# EAGLE design garden_logger (EAGLE 7.7.0)
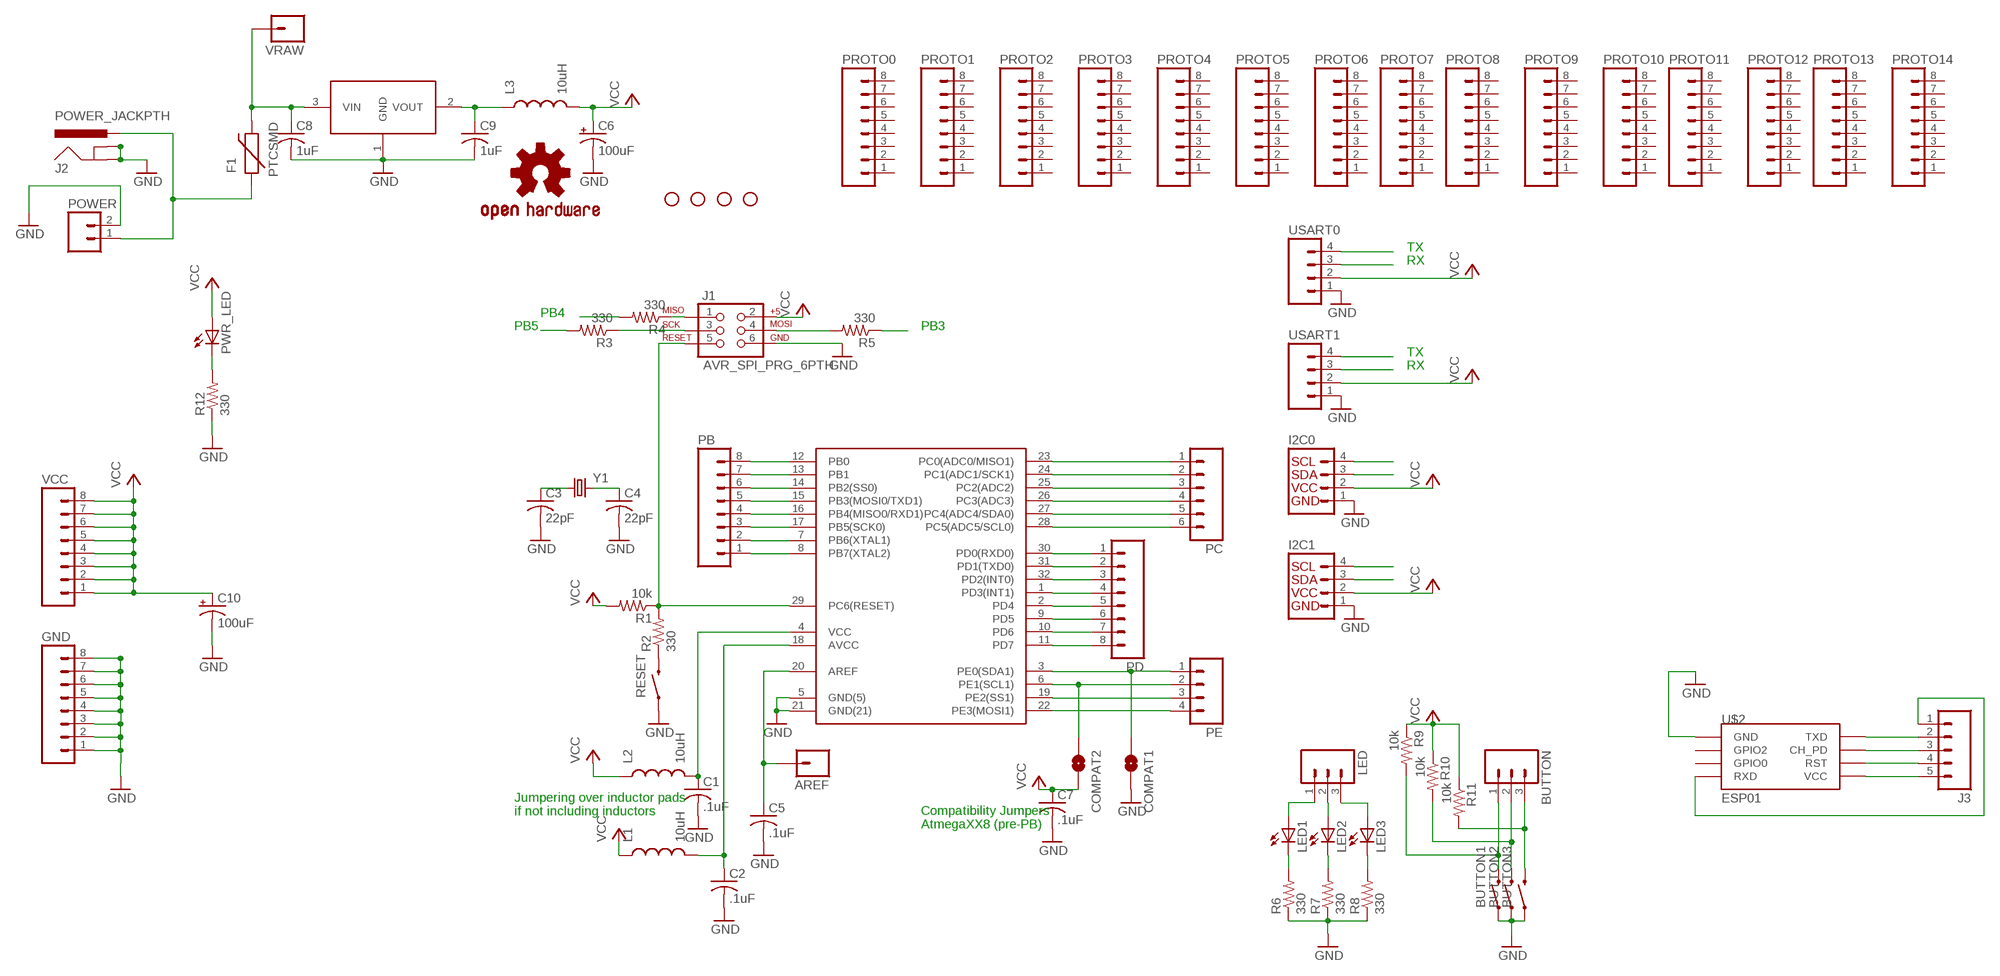
[diagram p0: schematic, sheet 1]

## Parts
AREF  M01PTH  [1X01]
BUTTON  M03PTH  [1X03]
BUTTON1  SWITCH-MOMENTARY-2PTH  [TACTILE-PTH]
BUTTON2  SWITCH-MOMENTARY-2PTH  [TACTILE-PTH]
BUTTON3  SWITCH-MOMENTARY-2PTH  [TACTILE-PTH]
C1  .1uF  C-USC0805  [C0805]
C2  .1uF  C-USC0805  [C0805]
C3  22pF  C-USC0805  [C0805]
C4  22pF  C-USC0805  [C0805]
C5  .1uF  C-USC0805  [C0805]
C6  100uF  CAP_POLPTH1  [CPOL-RADIAL-100UF-25V]
C7  .1uF  C-USC0805  [C0805]
C8  1uF  C-USC0805  [C0805]
C9  1uF  C-USC0805  [C0805]
C10  100uF  CAP_POLPTH1  [CPOL-RADIAL-100UF-25V]
COMPAT1  SOLDERJUMPER-OLDNO  [SJ_2S-NO]
COMPAT2  SOLDERJUMPER-OLDNO  [SJ_2S-NO]
F1  PTCSMD  [PTC-1206]
GND  M08  [1X08_ROUND]
H1  STAND-OFF  [STAND-OFF]
H2  STAND-OFF  [STAND-OFF]
H3  STAND-OFF  [STAND-OFF]
H4  STAND-OFF  [STAND-OFF]
I2C0  I2C_STANDARD  [1X04]
I2C1  I2C_STANDARD  [1X04]
J1  AVR_SPI_PRG_6PTH  [2X3]
J2  POWER_JACKPTH  [POWER_JACK_PTH]
J3  M05PTH  [1X05]
L1  10uH  INDUCTOR0805  [0805]
L2  10uH  INDUCTOR0805  [0805]
L3  10uH  INDUCTOR0805  [0805]
LED  M03PTH  [1X03]
LED1  LEDCHIPLED_0805  [CHIPLED_0805]
LED2  LEDCHIPLED_0805  [CHIPLED_0805]
LED3  LEDCHIPLED_0805  [CHIPLED_0805]
LOGO1  OSHW-LOGOS  [OSHW-LOGO-S]
PB  M08  [1X08_ROUND]
PC  M06SILK_FEMALE_PTH  [1X06]
PD  M08  [1X08_ROUND]
PE  M04PTH  [1X04]
POWER  M02PTH  [1X02]
PROTO0  M08  [1X08_ROUND]
PROTO1  M08  [1X08_ROUND]
PROTO2  M08  [1X08_ROUND]
PROTO3  M08  [1X08_ROUND]
PROTO4  M08  [1X08_ROUND]
PROTO5  M08  [1X08_ROUND]
PROTO6  M08  [1X08_ROUND]
PROTO7  M08  [1X08_ROUND]
PROTO8  M08  [1X08_ROUND]
PROTO9  M08  [1X08_ROUND]
PROTO10  M08  [1X08_ROUND]
PROTO11  M08  [1X08_ROUND]
PROTO12  M08  [1X08_ROUND]
PROTO13  M08  [1X08_ROUND]
PROTO14  M08  [1X08_ROUND]
PWR_LED  LEDCHIPLED_0805  [CHIPLED_0805]
R1  10k  R-US_R0805  [R0805]
R2  330  R-US_R0805  [R0805]
R3  330  R-US_R0805  [R0805]
R4  330  R-US_R0805  [R0805]
R5  330  R-US_R0805  [R0805]
R6  330  R-US_R0805  [R0805]
R7  330  R-US_R0805  [R0805]
R8  330  R-US_R0805  [R0805]
R9  10k  R-US_R0805  [R0805]
R10  10k  R-US_R0805  [R0805]
R11  10k  R-US_R0805  [R0805]
R12  330  R-US_R0805  [R0805]
RESET  SWITCH-MOMENTARY-2PTH  [TACTILE-PTH]
U$1  ATMEGA328PB_TQFP  [TQFP32-08]
U$2  ESP01  [ESP01]
U$3  MCP1702  [SOT23-3]
USART0  M04PTH  [1X04]
USART1  M04PTH  [1X04]
VCC  M08  [1X08_ROUND]
VRAW  M01PTH  [1X01]
Y1  CRYSTALHC49US  [HC49US]

## Nets
AVCC: C2.1 L1.2 U$1.18(AVCC)
AVRVCC: C1.1 L2.2 U$1.4(VCC)
ESP01_CH_PD: J3.3 U$2.CH_PD
ESP01_RST: J3.4 U$2.RST
ESP01_RXD: J3.1 U$2.RX(RXD)
ESP01_TXD: J3.2 U$2.TX(TXD)
ESP01_VCC: J3.5 U$2.VCC
GND: BUTTON1.1 BUTTON2.1 BUTTON3.1 C1.2 C2.2 C3.2 C4.2 C5.2 C6.2(-) C7.2 C8.2 C9.2 C10.2(-) COMPAT1.2 GND.1 GND.2 GND.3 GND.4 GND.5 GND.6 GND.7 GND.8 I2C0.1 I2C1.1 J1.6 J2.GND J2.GNDBREAK POWER.2 R6.1 R7.1 R8.1 R12.1 RESET.1 U$1.5(GND(5)) U$1.21(GND(21)) U$2.GND U$3.1(GND) USART0.1 USART1.1
N$1: AREF.1 C5.1 U$1.20(AREF)
N$2: R2.1 RESET.3
N$3: J1.1 R4.1
N$4: J1.3 R3.1
N$5: J1.4 R5.2
N$8: C8.1 F1.2 U$3.3(VIN) VRAW.1
N$9: PWR_LED.C R12.2
N$10: F1.1 J2.PWR POWER.1
N$11: LED1.C R6.2
N$14: LED2.C R7.2
N$15: LED3.C R8.2
N$16: LED1.A LED.1
N$17: LED2.A LED.2
N$18: LED3.A LED.3
N$19: C9.1 L3.1 U$3.2(VOUT)
N$20: BUTTON3.3 BUTTON.3 R11.2
N$21: BUTTON2.3 BUTTON.2 R10.2
N$22: BUTTON1.3 BUTTON.1 R9.2
PB0: PB.8 U$1.12(PB0)
PB1: PB.7 U$1.13(PB1)
PB2: PB.6 U$1.14(PB2(SS0))
PB3: PB.5 R5.1 U$1.15(PB3(MOSI0/TXD1)) USART1.4
PB4: PB.4 R4.2 U$1.16(PB4(MISO0/RXD1)) USART1.3
PB5: PB.3 R3.2 U$1.17(PB5(SCK0))
PB6: C3.1 PB.2 U$1.7(PB6(XTAL1)) Y1.1
PB7: C4.1 PB.1 U$1.8(PB7(XTAL2)) Y1.2
PC0: PC.1 U$1.23(PC0(ADC0/MISO1))
PC1: PC.2 U$1.24(PC1(ADC1/SCK1))
PC2: PC.3 U$1.25(PC2(ADC2))
PC3: PC.4 U$1.26(PC3(ADC3))
PC4: I2C0.3 PC.5 U$1.27(PC4(ADC4/SDA0))
PC5: I2C0.4 PC.6 U$1.28(PC5(ADC5/SCL0))
PC6: J1.5 R1.1 R2.2 U$1.29(PC6(RESET))
PD0: PD.1 U$1.30(PD0(RXD0)) USART0.3
PD1: PD.2 U$1.31(PD1(TXD0)) USART0.4
PD2: PD.3 U$1.32(PD2(INT0))
PD3: PD.4 U$1.1(PD3(INT1))
PD4: PD.5 U$1.2(PD4)
PD5: PD.6 U$1.9(PD5)
PD6: PD.7 U$1.10(PD6)
PD7: PD.8 U$1.11(PD7)
PE0: COMPAT1.1 I2C1.3 PE.1 U$1.3(PE0(SDA1))
PE1: COMPAT2.1 I2C1.4 PE.2 U$1.6(PE1(SCL1))
PE2: PE.3 U$1.19(PE2(SS1))
PE3: PE.4 U$1.22(PE3(MOSI1))
VCC: C6.1(+) C7.1 C10.1(+) COMPAT2.2 I2C0.2 I2C1.2 J1.2 L1.1 L2.1 L3.2 PWR_LED.A R1.2 R9.1 R10.1 R11.1 USART0.2 USART1.2 VCC.1 VCC.2 VCC.3 VCC.4 VCC.5 VCC.6 VCC.7 VCC.8
Unconnected: PROTO0.1 PROTO0.2 PROTO0.3 PROTO0.4 PROTO0.5 PROTO0.6 PROTO0.7 PROTO0.8 PROTO1.1 PROTO1.2 PROTO1.3 PROTO1.4 PROTO1.5 PROTO1.6 PROTO1.7 PROTO1.8 PROTO2.1 PROTO2.2 PROTO2.3 PROTO2.4 PROTO2.5 PROTO2.6 PROTO2.7 PROTO2.8 PROTO3.1 PROTO3.2 PROTO3.3 PROTO3.4 PROTO3.5 PROTO3.6 PROTO3.7 PROTO3.8 PROTO4.1 PROTO4.2 PROTO4.3 PROTO4.4 PROTO4.5 PROTO4.6 PROTO4.7 PROTO4.8 PROTO5.1 PROTO5.2 PROTO5.3 PROTO5.4 PROTO5.5 PROTO5.6 PROTO5.7 PROTO5.8 PROTO6.1 PROTO6.2 PROTO6.3 PROTO6.4 PROTO6.5 PROTO6.6 PROTO6.7 PROTO6.8 PROTO7.1 PROTO7.2 PROTO7.3 PROTO7.4 PROTO7.5 PROTO7.6 PROTO7.7 PROTO7.8 PROTO8.1 PROTO8.2 PROTO8.3 PROTO8.4 PROTO8.5 PROTO8.6 PROTO8.7 PROTO8.8 PROTO9.1 PROTO9.2 PROTO9.3 PROTO9.4 PROTO9.5 PROTO9.6 PROTO9.7 PROTO9.8 PROTO10.1 PROTO10.2 PROTO10.3 PROTO10.4 PROTO10.5 PROTO10.6 PROTO10.7 PROTO10.8 PROTO11.1 PROTO11.2 PROTO11.3 PROTO11.4 PROTO11.5 PROTO11.6 PROTO11.7 PROTO11.8 PROTO12.1 PROTO12.2 PROTO12.3 PROTO12.4 PROTO12.5 PROTO12.6 PROTO12.7 PROTO12.8 PROTO13.1 PROTO13.2 PROTO13.3 PROTO13.4 PROTO13.5 PROTO13.6 PROTO13.7 PROTO13.8 PROTO14.1 PROTO14.2 PROTO14.3 PROTO14.4 PROTO14.5 PROTO14.6 PROTO14.7 PROTO14.8 U$2.GPIO0 U$2.GPIO2

## Notes on the sheet
- TX
- RX
- PB4
- PB5 | PB3
- TX
- RX
- Jumpering over inductor pads 
  if not including inductors
- Compatibility Jumpers
  AtmegaXX8 (pre-PB)

## Library data of the parts
AREF VRAW = SparkFun-Connectors:M01: Header 1 Standard 1-pin 0.1" header. Use with straight break away headers (SKU : PRT-00116), right angle break away headers (PRT-00553), swiss pins (PRT-00743), machine pins (PRT-00117), and female headers (PRT-00115). SMTSO-256-ET is a "flush mount" nut for a 4-40 screw. The older package used to be too tight, and did not allow it to sit properly thru the drill hit. The latest (0.165DIA) fits nice and snug.
BUTTON LED = SparkFun-Connectors:M03: Header 3 Standard 3-pin 0.1" header. Use with straight break away headers (SKU : PRT-00116), right angle break away headers (PRT-00553), swiss pins (PRT-00743), machine pins (PRT-00117), and female headers (PRT-00115). Molex polarized connector foot print use with SKU : PRT-08232 with associated crimp pins and housings.
BUTTON1-BUTTON3 RESET = SparkFun-Electromechanical:SWITCH-MOMENTARY-2: Various NO switches- pushbuttons, reed, etc; PROD_ID: SWCH-08441
C1-C5 C7-C9 = rcl:C-US: CAPACITOR, American symbol
C6 C10 = SparkFun-Passives:CAP_POL: Capacitor Polarized These are standard SMD and PTH capacitors. Normally 10uF, 47uF, and 100uF in electrolytic and tantalum varieties. Always verify the external diameter of the through hole cap, it varies with capacity, voltage, and manufacturer. The EIA devices should be standard.
COMPAT1 COMPAT2 = SparkFun-Retired:SOLDERJUMPER-OLD: Solder Jumper Standard SMD solder jumper. Used to automate production. Two varients : Normally Open and Normally Closed are the same, but have different paste layers. NC will have a large amount of paste and should jumper during reflow.
F1 = SparkFun-PowerIC:PTC: Resettable Fuse PTC Resettable Fuse. Spark Fun Electronics SKU : COM-08357; PROD_ID: RES-11150
GND PB PD PROTO0 PROTO1-PROTO14 VCC = SparkFun-Connectors:M08: Header 8 Standard 8-pin 0.1" header. Use with straight break away headers (SKU : PRT-00116), right angle break away headers (PRT-00553), swiss pins (PRT-00743), machine pins (PRT-00117), and female headers (PRT-00115).; PROD_ID: CONN-08437
H1-H4 = SparkFun-Electromechanical:STAND-OFF: #4 Stand Off This is the mechanical footprint for a #4 phillips button head screw. Use the keepout ring to avoid running the screw head into surrounding components. SKU : PRT-00447
I2C0 I2C1 = SparkFun-Connectors:I2C_STANDARD: SparkFun has standardized on a pinout for all I2C based sensor breakouts. This pinout allows I2C boards to be plugged directly into the headers on Arduino Uno compatible boards, and to be daisy chained easily.
J1 = SparkFun-Connectors:AVR_SPI_PRG_6: AVR ISP 6 Pin This is the reduced ISP connector for AVR programming. Common on Arduino. This footprint will take up less PCB space and can be used with a 10-pin to 6-pin adapter such as SKU: BOB-08508 **Special note about "TEST_POINT" package. The stop mask is on the top side, so if you want your programming test points to be on the bottom of your board, make sure to place this package on the bottom side of the board. This also ensure that the orientation to program from the bottom side will be correct.
J2 = SparkFun-Connectors:POWER_JACK: Power Jack This is the standard 5.5mm barrel jack for power. The PTH is the most common, proven, reliable, footprint. The Slot footprint only works if the mill layer is transmitted to the PCB fab house so be warned. Mating wall wart : TOL-00298 (and others); PROD_ID: CONN-08197
J3 = SparkFun-Connectors:M05: Header 5 Standard 5-pin 0.1" header. Use with straight break away headers (SKU : PRT-00116), right angle break away headers (PRT-00553), swiss pins (PRT-00743), machine pins (PRT-00117), and female headers (PRT-00115). Molex polarized connector foot print use with SKU : PRT-08230 with associated crimp pins and housings.
L1-L3 = SparkFun-Passives:INDUCTOR: Inductors Basic Inductor/Choke - 0603 and 1206. Footprints are not proven and vary greatly between part numbers. INDUCTOR POWER 3.3UH 4.0A SMD 0.197" L x 0.197" W x 0.177" H (5.00mm x 5.00mm x 4.50mm)
LED1-LED3 PWR_LED = led:LED: LED OSRAM: - CHIPLED LG R971, LG N971, LY N971, LG Q971, LY Q971, LO R971, LY R971 LH N974, LH R974 LS Q976, LO Q976, LY Q976 LO Q996 - Hyper CHIPLED LW Q18S LB Q993, LB Q99A, LB R99A - SideLED LS A670, LO A670, LY A670, LG A670, LP A670 LB A673, LV A673, LT A673, LW A673 LH A674 LY A675 LS A676, LA A676, LO A676, LY A676, LW A676 LS A679, LY A679, LG A679 - Hyper Micro SIDELED® LS Y876, LA Y876, LO Y876, LY Y876 LT Y87S - SmartLED LW L88C, LW L88S LB L89C, LB L89S, LG L890 LS L89K, LO L89K, LY L89K LS L896, LA L896, LO L896, LY L896 - TOPLED LS T670, LO T670, LY T670, LG T670, LP T670 LSG T670, LSP T670, LSY T670, LOP T670, LYG T670 LG T671, LOG T671, LSG T671 LB T673, LV T673, LT T673, LW T673 LH T674 LS T676, LA T676, LO T676, LY T676, LB T676, LH T676, LSB T676, LW T676 LB T67C, LV T67C, LT T67C, LS T67K, LO T67K, LY T67K, LW E67C LS E67B, LA E67B, LO E67B, LY E67B, LB E67C, LV E67C, LT E67C LW T67C LS T679, LY T679, LG T679 LS T770, LO T770, LY T770, LG T770, LP T770 LB T773, LV T773, LT T773, LW T773 LH T774 LS E675, LA E675, LY E675, LS T675 LS T776, LA T776, LO T776, LY T776, LB T776 LHGB T686 LT T68C, LB T68C - Hyper Mini TOPLED® LB M676 - Mini TOPLED Santana® LG M470 LS M47K, LO M47K, LY M47K Source: http://www.osram.convergy.de LUXEON: - LUMILED® LXK2-PW12-R00, LXK2-PW12-S00, LXK2-PW14-U00, LXK2-PW14-V00 LXK2-PM12-R00, LXK2-PM12-S00, LXK2-PM14-U00 LXK2-PE12-Q00, LXK2-PE12-R00, LXK2-PE12-S00, LXK2-PE14-T00, LXK2-PE14-U00 LXK2-PB12-K00, LXK2-PB12-L00, LXK2-PB12-M00, LXK2-PB14-N00, LXK2-PB14-P00, LXK2-PB14-Q00 LXK2-PR12-L00, LXK2-PR12-M00, LXK2-PR14-Q00, LXK2-PR14-R00 LXK2-PD12-Q00, LXK2-PD12-R00, LXK2-PD12-S00 LXK2-PH12-R00, LXK2-PH12-S00 LXK2-PL12-P00, LXK2-PL12-Q00, LXK2-PL12-R00 Source: www.luxeon.com KINGBRIGHT: KA-3528ASYC Source: www.kingbright.com
LOGO1 = SparkFun-Aesthetics:OSHW-LOGO: Open Source Hardware Logo This logo indicates the piece of hardware it is found on incorporates a OSHW license and/or adheres to the definition of open source hardware found here: http://freedomdefined.org/OSHW
PC = SparkFun-Connectors:M06: Header 6 Standard 6-pin 0.1" header. Use with straight break away headers (SKU : PRT-00116), right angle break away headers (PRT-00553), swiss pins (PRT-00743), machine pins (PRT-00117), and female headers (PRT-00115). Molex polarized connector foot print use with SKU : PRT-08094 with associated crimp pins and housings. NOTES ON THE VARIANTS LOCK and LOCK_LONGPADS... This footprint was designed to help hold the alignment of a through-hole component (i.e. 6-pin header) while soldering it into place. You may notice that each hole has been shifted either up or down by 0.005 of an inch from it's more standard position (which is a perfectly straight line). This slight alteration caused the pins (the squares in the middle) to touch the edges of the holes. Because they are alternating, it causes a "brace" to hold the component in place. 0.005 has proven to be the perfect amount of "off-center" position when using our standard breakaway headers. Although looks a little odd when you look at the bare footprint, once you have a header in there, the alteration is very hard to notice. Also,if you push a header all the way into place, it is covered up entirely on the bottom side. This idea of altering the position of holes to aid alignment will be further integrated into the Sparkfun Library for other footprints. It can help hold any component with 3 or more connection pins.; PROD_ID: CONN-08437
PE USART0 USART1 = SparkFun-Connectors:M04: Header 4 Standard 4-pin 0.1" header. Use with straight break away headers (SKU : PRT-00116), right angle break away headers (PRT-00553), swiss pins (PRT-00743), machine pins (PRT-00117), and female headers (PRT-00115). Molex polarized connector foot print use with SKU : PRT-08231 with associated crimp pins and housings. 1MM SMD Version SKU: PRT-10208; PROD_ID: CONN-09696
POWER = SparkFun-Connectors:M02: Standard 2-pin 0.1" header. Use with - straight break away headers ( PRT-00116) - right angle break away headers (PRT-00553) - swiss pins (PRT-00743) - machine pins (PRT-00117) - female headers (PRT-00115) Molex polarized connector foot print use with: PRT-08233 with associated crimp pins and housings. 2.54_SCREWTERM for use with PRT-10571. 3.5mm Screw Terminal footprints for PRT-08084 5mm Screw Terminal footprints for use with PRT-08432
R1-R12 = rcl:R-US_: RESISTOR, American symbol
U$1 = zjembedded_eagle:ATMEGA328PB_TQFP
U$2 = esp8266modules:ESP01: ESP8266 Wifi module 01
U$3 = zjembedded_eagle:MCP1702
Y1 = SparkFun-FreqCtrl:CRYSTAL: Various standard crystals. Proven footprints.

## Board
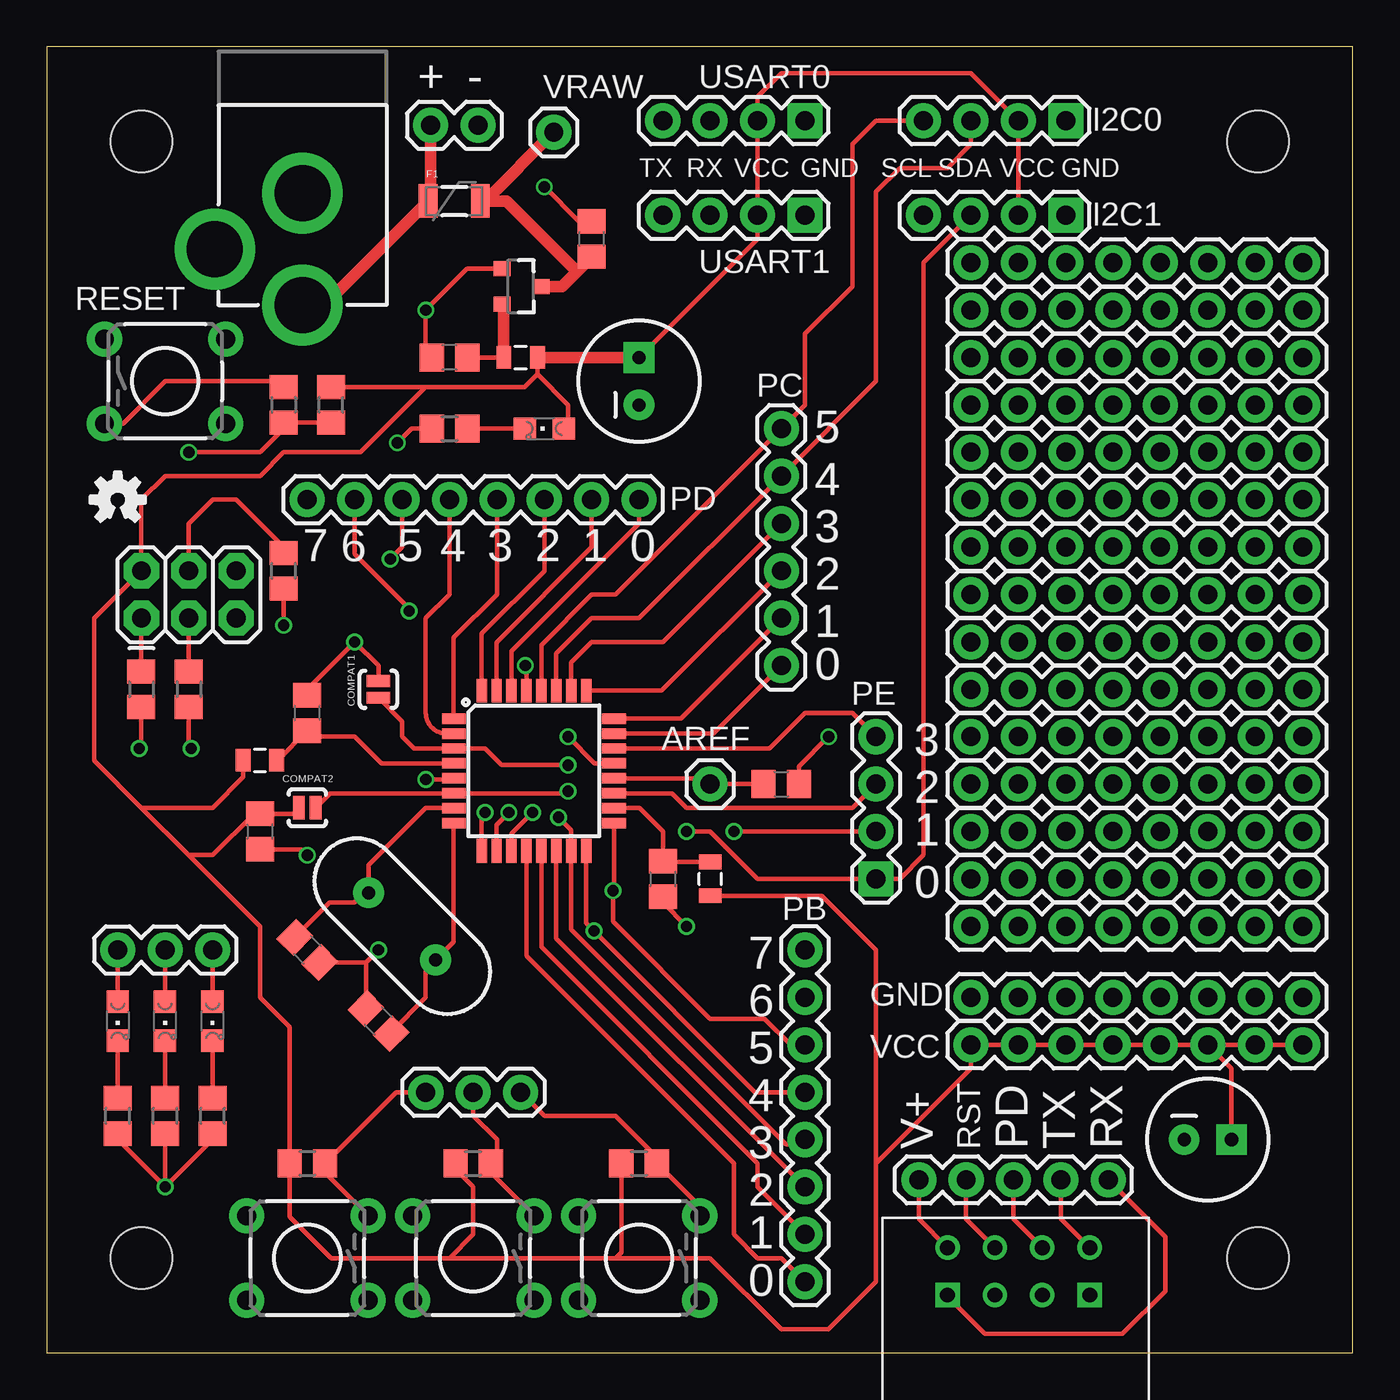
[diagram p1: board, top side]
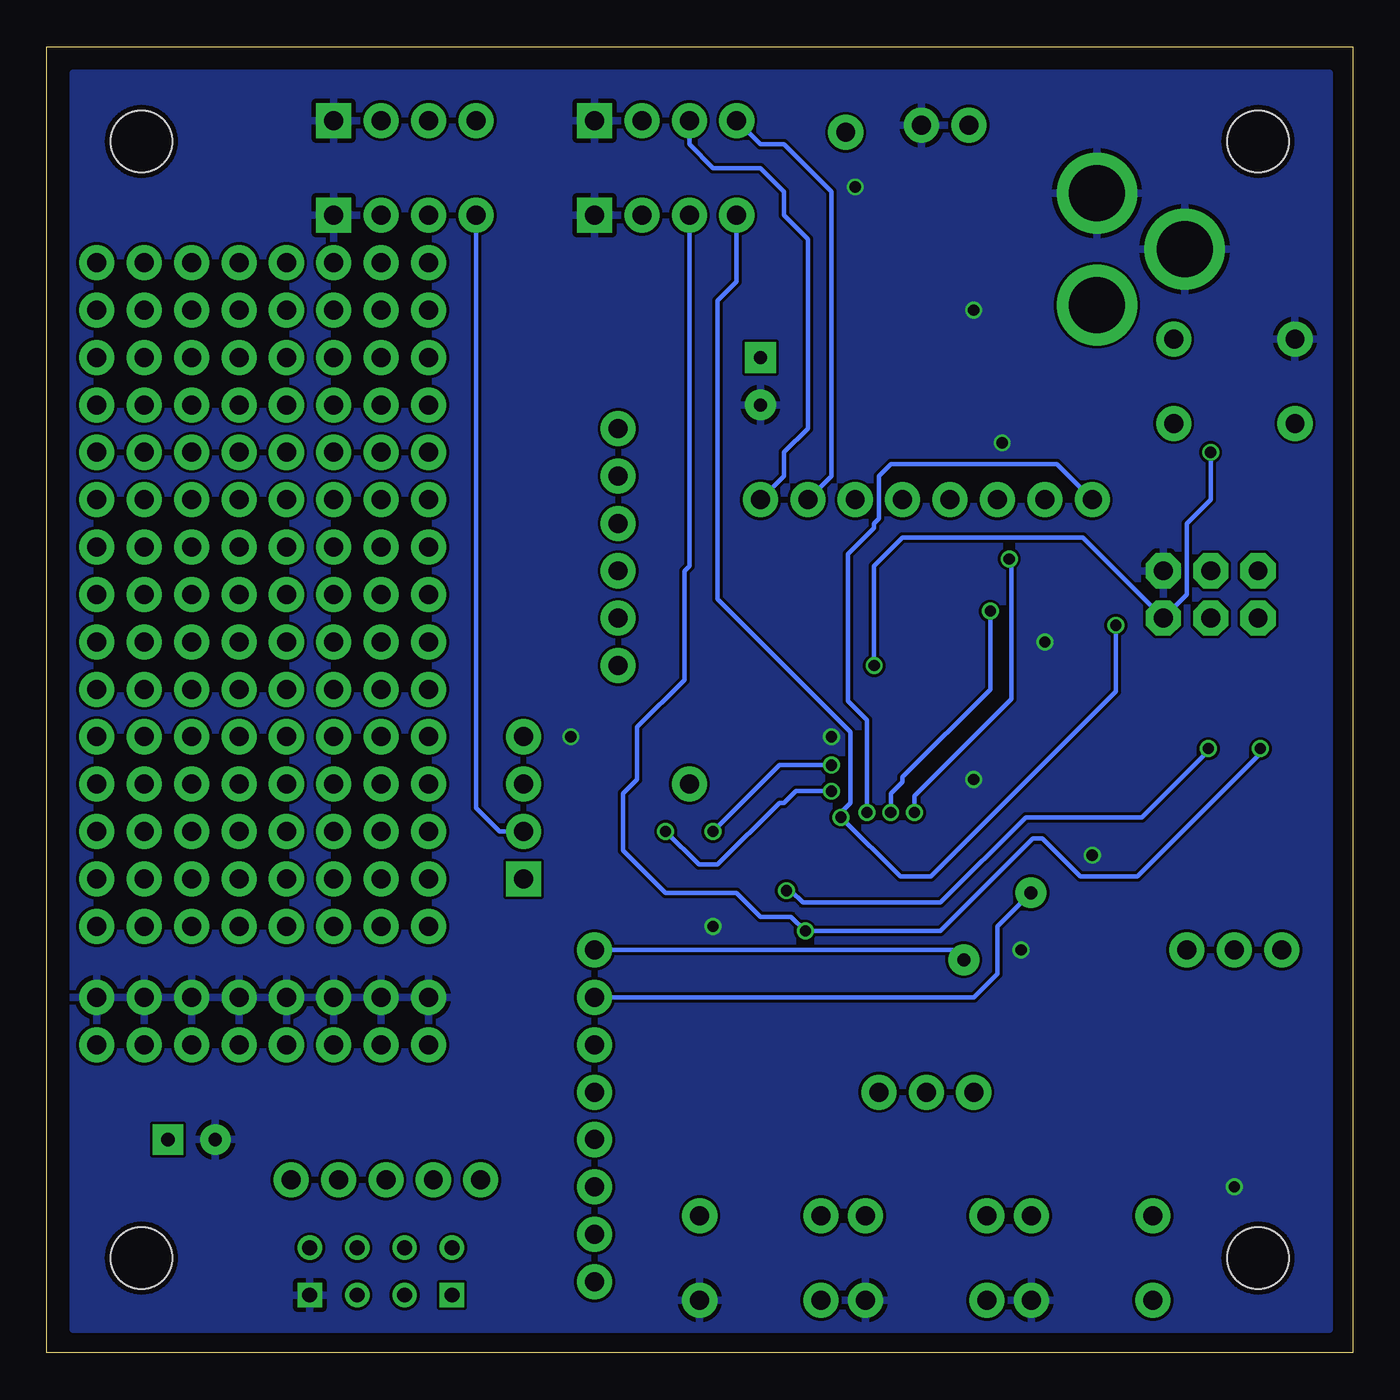
[diagram p2: board, bottom side, seen from below]

Size 70 x 70 mm. Coordinates in mm from the lower left corner, seen from the top.
Outline: 0,0 70,0 70,70 0,70 0,0
Copper layers (1*16): Top 0.035mm / dielectric 1.5mm / Bottom 0.035mm
Design rules "SeeedStudio_2layer_DRU_no_angle_20140221": minimum track width 6mil, minimum drill 12mil, track to track 6mil, track to pad 6mil, pad to pad 6mil, via to via 6mil, smd to smd 0mil, copper to edge 10mil, drill to drill 10mil, minimum pad ring 10mil, minimum via ring 6mil, stop-mask expansion 2mil, vias tented up to drill 100mil, thermal gap 10mil

### Footprints (pad centres in the part's own frame; a part is rotated, then mirrored left to right if it is on the bottom)
1X01 = drill 1.016 pad 1.88: 1 0,0
1X03 = drill 1.016 pad 1.88: 1 0,0; 2 2.54,0; 3 5.08,0
TACTILE-PTH = drill 1.016 pad 1.88: 1 -3.251,2.261; 2 3.251,2.261; 3 -3.251,-2.261; 4 3.251,-2.261
C0805 = smd 1.3 x 1.5: 1 -0.95,0; 2 0.95,0
CPOL-RADIAL-100UF-25V = drill 0.7 pad 1.651 square: 1 1.27,0 | drill 0.7 pad 1.651: 2 -1.27,0
SJ_2S-NO = smd 0.635 x 1.27: 1 -0.45,0; 2 0.45,0
PTC-1206 = smd 1 x 1.8: 1 -1.4,0; 2 1.4,0
1X08_ROUND = drill 1.016 pad 1.88: 1 0,0; 2 2.54,0; 3 5.08,0; 4 7.62,0; 5 10.16,0; 6 12.7,0; 7 15.24,0; 8 17.78,0
STAND-OFF = hole 3.302: 0,0
1X04 = drill 1.016 pad 1.88 square: 1 0,0 | drill 1.016 pad 1.88: 2 2.54,0; 3 5.08,0; 4 7.62,0
2X3 = drill 1.016 pad 1.88 octagon: 1 0,0; 2 0,2.54; 3 2.54,0; 4 2.54,2.54; 5 5.08,0; 6 5.08,2.54
POWER_JACK_PTH = drill 2.997 pad 4.318: GND 0,7.7; GNDBREAK 4.7,10.7; PWR 0,13.7
1X05 = drill 1.016 pad 1.88: 1 0,0; 2 2.54,0; 3 5.08,0; 4 7.62,0; 5 10.16,0
0805 = smd 0.8 x 1.2: 1 -0.9,0; 2 0.9,0
CHIPLED_0805 = smd 1.2 x 1.2: A 0,-1.05; C 0,1.05
1X06 = drill 1.016 pad 1.88: 1 0,0; 2 2.54,0; 3 5.08,0; 4 7.62,0; 5 10.16,0; 6 12.7,0
1X02 = drill 1.016 pad 1.88: 1 0,0; 2 2.54,0
R0805 = smd 1.3 x 1.5: 1 -0.95,0; 2 0.95,0
TQFP32-08 = smd 1.27 x 0.559: 1 -4.293,2.8; 2 -4.293,2; 3 -4.293,1.2; 4 -4.293,0.4; 5 -4.293,-0.4; 6 -4.293,-1.2; 7 -4.293,-2; 8 -4.293,-2.8; 17 4.293,-2.8; 18 4.293,-2; 19 4.293,-1.2; 20 4.293,-0.4; 21 4.293,0.4; 22 4.293,1.2; 23 4.293,2; 24 4.293,2.8 | smd 0.559 x 1.27: 9 -2.8,-4.293; 10 -2,-4.293; 11 -1.2,-4.293; 12 -0.4,-4.293; 13 0.4,-4.293; 14 1.2,-4.293; 15 2,-4.293; 16 2.8,-4.293; 25 2.8,4.293; 26 2,4.293; 27 1.2,4.293; 28 0.4,4.293; 29 -0.4,4.293; 30 -1.2,4.293; 31 -2,4.293; 32 -2.8,4.293
ESP01 = drill 0.8: CH_PD -1.285,-8.178; GPIO0 1.255,-5.638; GPIO2 -1.285,-5.638; RST 1.255,-8.178; TX -3.825,-8.178; VCC 3.795,-8.178 | drill 0.8 square: GND -3.825,-5.638; RX 3.795,-5.638
SOT23-3 = smd 0.8 x 0.9: 1 -0.95,-1; 2 0.95,-1; 3 0,1.1
HC49US = drill 0.7 pad 1.651: 1 -2.54,0; 2 2.54,0

### Placement (x,y rotation side)
AREF  35.56,30.48 0 top
BUTTON  20.32,13.97 0 top
BUTTON1  13.97,5.08 180 top
BUTTON2  22.86,5.08 180 top
BUTTON3  31.75,5.08 180 top
C1  13.97,34.29 90 top
C2  33.02,25.4 270 top
C3  13.97,21.59 315 top
C4  17.78,17.78 135 top
C5  39.37,30.48 0 top
C6  31.75,52.07 90 top
C7  11.43,27.94 270 top
C8  29.21,59.69 90 top
C9  21.59,53.34 180 top
C10  62.23,11.43 0 top
COMPAT1  17.78,35.56 90 top
COMPAT2  13.97,29.21 180 top
F1  21.84,61.72 0 top
GND  49.53,19.05 0 top
H1  5.08,5.08 0 top
H2  64.92,5.08 0 top
H3  5.08,64.92 0 top
H4  64.92,64.92 0 top
I2C0  54.61,66.04 180 top
I2C1  54.61,60.96 180 top
J1  5.08,39.37 0 top
J2  13.72,69.85 180 top
J3  56.9,9.27 180 top
L1  35.56,25.4 90 top
L2  11.43,31.75 0 top
L3  25.4,53.34 0 top
LED  3.81,21.59 0 top
LED1  3.81,17.78 180 top
LED2  6.35,17.78 180 top
LED3  8.89,17.78 180 top
LOGO1  3.81,45.72 0 top
PB  40.64,21.59 270 top
PC  39.37,36.83 90 top
PD  31.75,45.72 180 top
PE  44.45,25.4 90 top
POWER  20.57,65.79 0 top
PROTO0  49.53,22.86 0 top
PROTO1  49.53,25.4 0 top
PROTO2  49.53,27.94 0 top
PROTO3  49.53,30.48 0 top
PROTO4  49.53,33.02 0 top
PROTO5  49.53,35.56 0 top
PROTO6  49.53,38.1 0 top
PROTO7  49.53,40.64 0 top
PROTO8  49.53,43.18 0 top
PROTO9  49.53,45.72 0 top
PROTO10  49.53,48.26 0 top
PROTO11  49.53,50.8 0 top
PROTO12  49.53,53.34 0 top
PROTO13  49.53,55.88 0 top
PROTO14  49.53,58.42 0 top
PWR_LED  26.67,49.53 90 top
R1  15.24,50.8 90 top
R2  12.7,50.8 270 top
R3  7.62,35.56 270 top
R4  5.08,35.56 270 top
R5  12.7,41.91 90 top
R6  3.81,12.7 90 top
R7  6.35,12.7 90 top
R8  8.89,12.7 90 top
R9  13.97,10.16 0 top
R10  22.86,10.16 0 top
R11  31.75,10.16 0 top
R12  21.59,49.53 0 top
RESET  6.35,52.07 0 top
U$1  26.11,31.19 0 top
U$2  52.07,-2.54 180 top
U$3  25.4,57.15 270 top
USART0  40.64,66.04 180 top
USART1  40.64,60.96 180 top
VCC  49.53,16.51 0 top
VRAW  27.18,65.41 0 top
Y1  19.05,22.86 315 top

### Tracks (layer width: path | path; a pad name or v marks a point on that pad's centre or on a via)
AVCC
  Top 0.254: U$1.18 31.77,29.19 33.02,27.94 C2.1 33.07,26.3 L1.2
AVRVCC
  Top 0.254: U$1.4 17.94,31.59 16.51,33.02 14.29,33.02 C1.1 12.38,31.75 L2.2
ESP01_CH_PD
  Top 0.254: J3.3 51.82,7.18 U$2.CH_PD
ESP01_RST
  Top 0.254: J3.4 49.28,7.18 U$2.RST
ESP01_RXD
  Top 0.254: U$2.RX 48.27,3.03 50.29,1.02 57.66,1.02 59.94,3.3 59.94,6.22 J3.1
ESP01_TXD
  Top 0.254: J3.2 54.36,7.18 U$2.TX
ESP01_VCC
  Top 0.254: J3.5 46.74,7.18 U$2.VCC
GND  (via drill 0.6, 0.6 pad 0.41)
  Top 0.254: R6.1 3.81,11.43 v6.35,8.89 | R8.1 8.89,11.43 v6.35,8.89 | R7.1 v6.35,8.89 | C3.2 17.11,20.92 | C4.2 17.11,20.92 | 17.11,20.92 v17.78,21.59 | U$3.1 22.54,58.1 v20.32,55.88 20.32,53.66 C9.2 | C7.2 13.65,26.99 v13.97,26.67 | C1.2 13.97,35.56 v16.51,38.1 17.78,36.83 COMPAT1.2 | C2.2 33.02,24.13 v34.29,22.86 | C5.2 40.32,31.43 v41.91,33.02 | U$1.21 29.37,31.59 v27.94,33.02 | v20.32,30.73 21.76,30.73 U$1.5 | C8.2 28.51,60.64 v26.67,62.48 | R12.1 19.56,49.53 v18.8,48.77
  pour Bottom: 1.27,68.58 1.27,1.27 68.58,1.27 68.58,68.58
N$1
  Top 0.254: U$1.20 35.25,30.79 AREF.1 C5.1
N$2
  Top 0.254: R2.1 12.38,52.07 6.35,52.07 4.09,49.81 RESET.3
N$3
  Top 0.254: R4.1 J1.1
N$4
  Top 0.254: R3.1 J1.3
N$5
  Top 0.254: J1.4 7.62,44.45 8.89,45.72 10.16,45.72 12.7,43.18 R5.2
N$8
  Top 0.61: 28.89,58.74 C8.1 28.41,57.95 | 28.41,57.95 27.62,57.15 U$3.3 | VRAW.1 23.5,61.72 F1.2 24.64,61.72 28.41,57.95
N$9
  Top 0.254: R12.2 PWR_LED.C
N$10
  Top 0.61: POWER.1 20.57,61.85 F1.1 14.87,56.15 J2.PWR
N$11
  Top 0.254: LED1.C R6.2
N$14
  Top 0.254: LED2.C R7.2
N$15
  Top 0.254: LED3.C R8.2
N$16
  Top 0.254: LED.1 LED1.A
N$17
  Top 0.254: LED.2 LED2.A
N$18
  Top 0.254: LED.3 LED3.A
N$19
  Top 0.254: U$3.2 24.5,56.1 | L3.1 C9.1
  Top 0.61: 24.5,56.1 L3.1
N$20
  Top 0.254: BUTTON3.3 34.72,7.62 34.72,8.14 R11.2 32.7,10.48 30.48,12.7 26.67,12.7 BUTTON.3
N$21
  Top 0.254: BUTTON.2 22.86,12.7 24.13,11.43 24.13,10.48 R10.2 23.81,9.64 BUTTON2.3
N$22
  Top 0.254: BUTTON.1 18.73,13.97 R9.2 14.92,9.64 BUTTON1.3
PB0
  Top 0.254: PB.8 39.37,5.08 38.1,5.08 36.83,6.35 36.83,10.16 25.71,21.28 U$1.12
PB1
  Top 0.254: U$1.13 26.51,21.75 38.1,10.16 38.1,8.89 PB.7
PB2
  Top 0.254: U$1.14 27.31,22.22 PB.6
PB3  (via drill 0.6 pad 0.41)
  Top 0.254: PB.5 40.39,11.18 39.62,11.18 28.11,22.69 U$1.15 28.11,28.02 v27.43,28.7 | R5.1 v12.7,38.99
  Bottom 0.254: v12.7,38.99 12.7,35.43 22.61,25.53 24.26,25.53 v27.43,28.7 27.43,28.96 26.92,29.46 26.92,33.27 34.04,40.39 34.04,56.39 33.02,57.4 USART1.4
PB4  (via drill 0.6 pad 0.41)
  Top 0.254: R4.2 5.08,32.51 v4.95,32.38 | U$1.16 28.91,23.03 v29.34,22.61 37.97,13.97 PB.4
  Bottom 0.254: v4.95,32.38 4.95,32.13 11.56,25.53 14.61,25.53 16.64,27.56 17.14,27.56 22.1,22.61 v29.34,22.61 30.1,23.37 31.75,23.37 33.02,24.64 36.83,24.64 39.12,26.92 39.12,29.97 38.35,30.73 38.35,33.53 35.81,36.07 35.81,41.91 35.56,42.16 USART1.3
PB5  (via drill 0.6 pad 0.41)
  Top 0.254: PB.3 39.88,16.51 38.48,17.91 35.56,17.91 30.35,23.11 v30.35,24.77 30.4,24.82 U$1.17 | R3.2 7.62,32.51 v7.75,32.38
  Bottom 0.254: v7.75,32.38 7.75,32.26 11.3,28.7 17.53,28.7 22.1,24.13 29.46,24.13 30.1,24.77 v30.35,24.77
PB6
  Top 0.254: U$1.7 21.8,29.21 20.32,29.21 17.25,26.14 Y1.1 17.04,24.66 16.51,24.13 15.17,24.13 C3.1
  Bottom 0.254: PB.2 20.32,19.05 19.05,20.32 19.05,22.86 Y1.1
PB7
  Top 0.254: U$1.8 21.82,22.04 21.48,21.7 Y1.2 20.32,20.54 20.32,19.05 18.45,17.18 C4.1
  Bottom 0.254: PB.1 21.37,21.59 Y1.2
PC0
  Top 0.254: U$1.23 35.73,33.19 PC.1
PC1
  Top 0.254: U$1.24 33.99,33.99 PC.2
PC2
  Top 0.254: U$1.25 32.94,35.48 PC.3
PC3
  Top 0.254: U$1.26 28.11,37 29.21,38.1 33.02,38.1 PC.4
PC4
  Top 0.254: U$1.27 27.31,37.47 29.21,39.37 31.75,39.37 PC.5 44.45,52.07 44.45,62.23 45.72,63.5 48.26,63.5 49.53,64.77 I2C0.3
PC5
  Top 0.254: U$1.28 26.51,37.94 29.21,40.64 30.48,40.64 PC.6 40.64,50.8 40.64,54.61 43.18,57.15 43.18,64.77 44.45,66.04 I2C0.4
PC6  (via drill 0.6 pad 0.41)
  Top 0.254: R1.1 R2.2 12.7,49.53 11.43,48.26 v7.62,48.26 | U$1.29 25.71,36.77 v25.65,36.83
  Bottom 0.254: v7.62,48.26 7.62,45.72 8.89,44.45 8.89,40.64 J1.5 14.48,43.69 24.13,43.69 25.65,42.16 v25.65,36.83
PD0
  Top 0.254: U$1.30 24.91,37.61 31.75,44.45 PD.1
  Bottom 0.254: USART0.3 35.56,64.77 34.29,63.5 31.75,63.5 30.48,62.23 30.48,60.96 29.21,59.69 29.21,49.53 30.48,48.26 30.48,46.99 PD.1
PD1
  Top 0.254: U$1.31 24.11,38.08 29.21,43.18 PD.2
  Bottom 0.254: PD.2 27.94,46.99 27.94,62.23 30.48,64.77 31.75,64.77 USART0.4
PD2
  Top 0.254: U$1.32 23.31,38.55 26.67,41.91 PD.3
PD3
  Top 0.254: U$1.1 21.82,38.33 24.13,40.64 PD.4
PD4
  Top 0.254: U$1.2 21.42,33.19 arc-90 20.32,34.29 20.32,39.37 21.59,40.64 PD.5
PD5  (via drill 0.6 pad 0.41)
  Top 0.254: U$1.9 23.31,28.77 v23.5,28.96 | PD.6 19.05,43.18 v18.41,42.55
  Bottom 0.254: v23.5,28.96 23.5,29.84 18.29,35.05 18.29,42.42 v18.41,42.55
PD6  (via drill 0.6 pad 0.41)
  Top 0.254: U$1.10 24.11,28.3 v24.77,28.96 | v19.43,39.75 19.43,39.88 16.51,42.8 PD.7
  Bottom 0.254: v24.77,28.96 24.77,29.97 24.13,30.61 24.13,30.86 19.43,35.56 v19.43,39.75
PD7  (via drill 0.6 pad 0.41)
  Top 0.254: U$1.11 24.91,27.83 v26.04,28.96
  Bottom 0.254: v26.04,28.96 26.04,33.91 27.05,34.92 27.05,42.8 25.65,44.2 25.65,44.45 25.4,44.7 25.4,46.99 24.77,47.62 15.88,47.62 PD.8
PE0  (via drill 0.6 pad 0.41)
  Top 0.254: COMPAT1.1 19.05,33.84 19.05,33.02 19.68,32.39 U$1.3 23.5,32.38 24.38,31.5 v27.94,31.5 | I2C1.3 46.99,58.42 46.99,26.67 45.72,25.4 PE.1 38.1,25.4 35.56,27.94 v34.29,27.94
  Bottom 0.254: v27.94,31.5 30.73,31.5 v34.29,27.94
PE1  (via drill 0.6 pad 0.41)
  Top 0.254: COMPAT2.1 15.2,29.99 U$1.6 27.83,29.99 v27.94,30.1 | v36.83,27.94 PE.2
  Bottom 0.254: PE.2 45.72,27.94 46.99,29.21 I2C1.4 | v27.94,30.1 29.84,30.1 30.48,29.46 30.73,29.46 34.04,26.16 35.05,26.16 v36.83,27.94
PE2
  Top 0.254: U$1.19 33.51,29.99 34.29,29.21 43.18,29.21 PE.3
PE3
  Top 0.254: U$1.22 38.74,32.39 40.64,34.29 43.18,34.29 PE.4
VCC
  Top 0.254: PWR_LED.A 27.94,49.75 27.94,50.8 26.3,52.44 | 26.3,52.44 L3.2 | 26.3,52.44 25.61,51.75 20.32,51.75 | 20.32,51.75 R1.2 | COMPAT2.2 13.2,28.89 C7.1 11.11,28.89 8.89,26.67 7.62,26.67 | 20.32,51.75 16.83,48.26 12.7,48.26 11.43,46.99 6.35,46.99 5.08,45.72 J1.2 2.54,39.37 2.54,31.75 5.08,29.21 | 7.62,26.67 11.43,22.86 11.43,19.05 13.02,17.46 R9.1 13.02,7.3 15.24,5.08 21.59,5.08 | 7.62,26.67 5.08,29.21 | 21.59,5.08 22.86,6.35 22.86,8.89 21.59,10.16 R10.1 | R11.1 30.8,5.4 30.48,5.08 | 30.48,5.08 21.59,5.08 | I2C1.2 I2C0.2 49.53,68.58 39.37,68.58 38.1,67.31 USART0.2 USART1.2 38.1,59.69 C6.1 | C10.1 63.5,15.24 VCC.6 | VCC.6 VCC.7 VCC.8 | VCC.6 VCC.5 VCC.4 VCC.3 VCC.2 VCC.1 49.53,15.24 44.45,10.16 | 44.45,10.16 44.45,3.81 41.91,1.27 39.37,1.27 35.56,5.08 30.48,5.08 | L1.1 41.54,24.5 44.45,21.59 44.45,10.16 | L2.1 10.53,30.85 8.89,29.21 5.08,29.21
  Top 0.61: L3.2 C6.1

### Text on the board
tNames: + | - | TX | RX | VCC | GND | SCL | SDA | VCC | GND | 5 | 4 | 3 | 7 | 6 | 5 | 4 | 3 | 2 | 1 | 0 | 2 | 1 | 0 | 3 | 2 | 1 | 0 | 7 | 6 | 5 | 4 | V+ | RST | PD | TX | RX | 3 | 2 | 1 | 0